# EAGLE design belamini-multi-a2 (EAGLE 9.6.0)
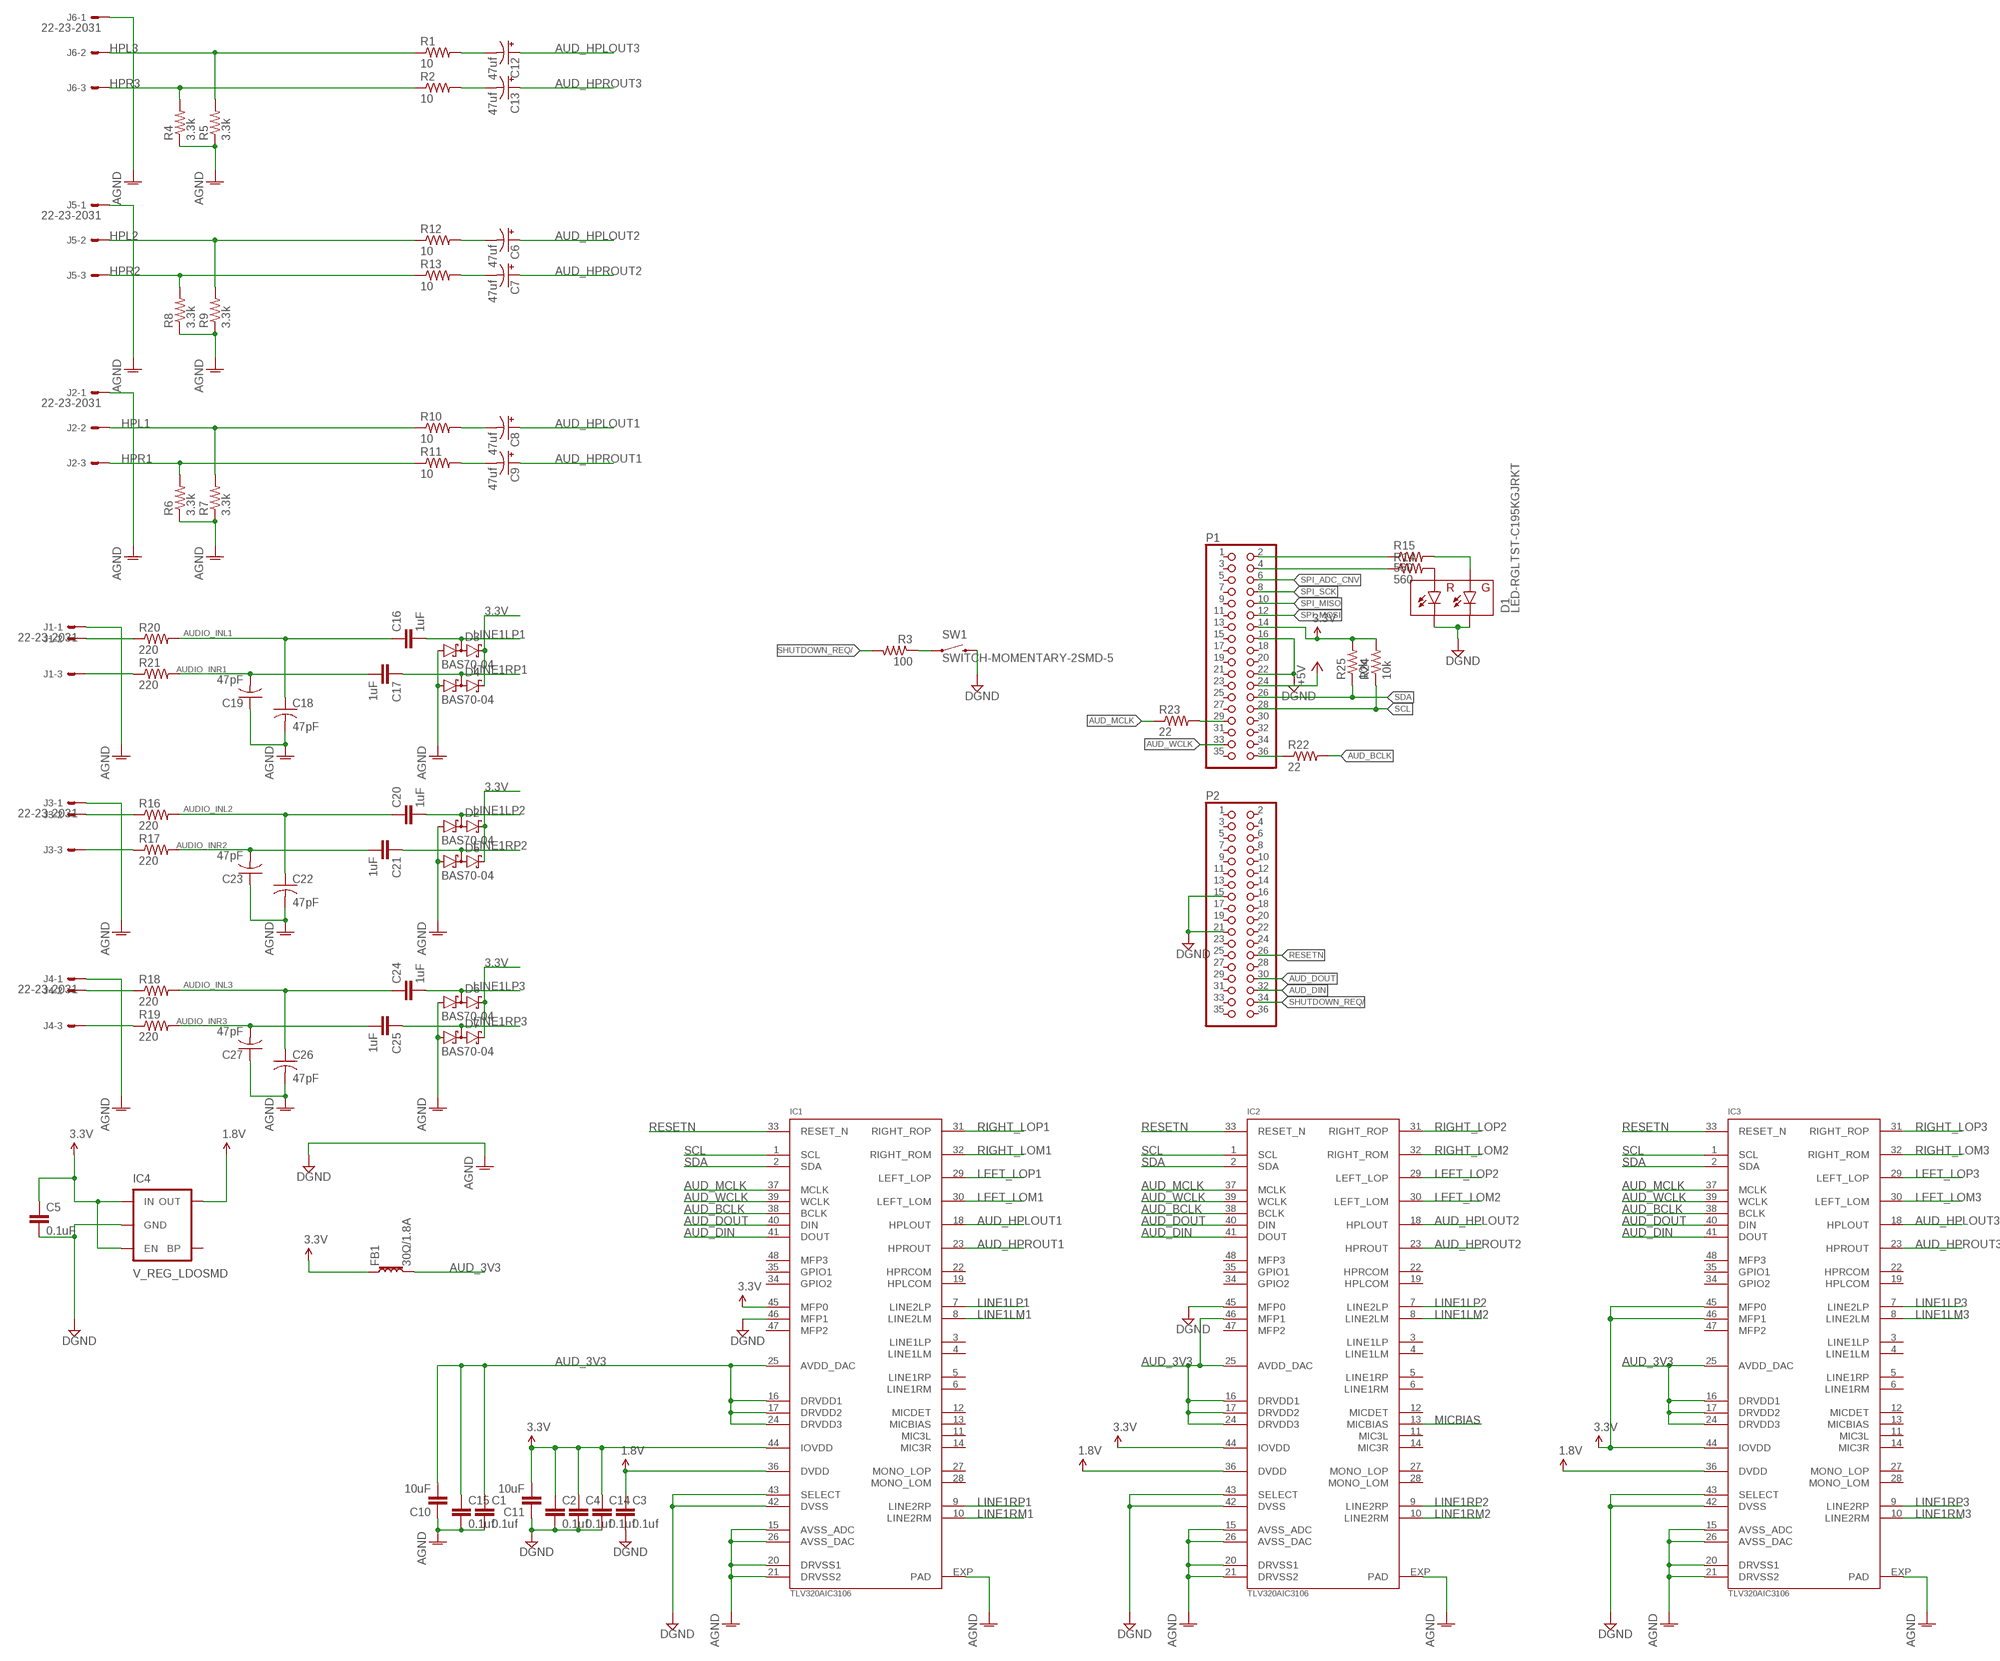
[diagram p0: schematic, sheet 1]

## Parts
C1  0.1uf  C-EUC0603  [C0603]
C2  0.1uf  C-EUC0603  [C0603]
C3  0.1uf  C-EUC0603  [C0603]
C4  0.1uf  C-EUC0603  [C0603]
C5  0.1uF  C-EUC0603  [C0603]
C6  47uf  CAP_POL1206  [EIA3216]
C7  47uf  CAP_POL1206  [EIA3216]
C8  47uf  CAP_POL1206  [EIA3216]
C9  47uf  CAP_POL1206  [EIA3216]
C10  10uF  CAP0603-CAP  [0603-CAP]
C11  10uF  CAP0603-CAP  [0603-CAP]
C12  47uf  CAP_POL1206  [EIA3216]
C13  47uf  CAP_POL1206  [EIA3216]
C14  0.1uf  C-EUC0603  [C0603]
C15  0.1uf  C-EUC0603  [C0603]
C16  1uF  C-EUC0603  [C0603]
C17  1uF  C-EUC0603  [C0603]
C18  47pF  C0402-SMALL  [C0402-SMALL]
C19  47pF  C0402-SMALL  [C0402-SMALL]
C20  1uF  C-EUC0603  [C0603]
C21  1uF  C-EUC0603  [C0603]
C22  47pF  C0402-SMALL  [C0402-SMALL]
C23  47pF  C0402-SMALL  [C0402-SMALL]
C24  1uF  C-EUC0603  [C0603]
C25  1uF  C-EUC0603  [C0603]
C26  47pF  C0402-SMALL  [C0402-SMALL]
C27  47pF  C0402-SMALL  [C0402-SMALL]
D1  LED-RGLTST-C195KGJRKT  [LTST-C195KGJRKT]
D2  BAS70-04  [SOT23]
D3  BAS70-04  [SOT23]
D4  BAS70-04  [SOT23]
D5  BAS70-04  [SOT23]
D6  BAS70-04  [SOT23]
D7  BAS70-04  [SOT23]
FB1  30Ω/1.8A  FERRITE_BEAD-0603  [0603]
IC1  TLV320AIC3106  TLV320AIC3106IRGZR"  [QFN48]
IC2  TLV320AIC3106  TLV320AIC3106IRGZR"  [QFN48]
IC3  TLV320AIC3106  TLV320AIC3106IRGZR"  [QFN48]
IC4  V_REG_LDOSMD  [SOT23-5]
J1  22-23-2031  [22-23-2031]
J2  22-23-2031  [22-23-2031]
J3  22-23-2031  [22-23-2031]
J4  22-23-2031  [22-23-2031]
J5  22-23-2031  [22-23-2031]
J6  22-23-2031  [22-23-2031]
P1  PINHD-2X18  [2X18]
P2  PINHD-2X18  [2X18]
R1  10  R0402-SMALL  [C0402-SMALL]
R2  10  R0402-SMALL  [C0402-SMALL]
R3  100  R0402-SMALL  [C0402-SMALL]
R4  3.3k  R0402-SMALL  [C0402-SMALL]
R5  3.3k  R0402-SMALL  [C0402-SMALL]
R6  3.3k  R0402-SMALL  [C0402-SMALL]
R7  3.3k  R0402-SMALL  [C0402-SMALL]
R8  3.3k  R0402-SMALL  [C0402-SMALL]
R9  3.3k  R0402-SMALL  [C0402-SMALL]
R10  10  R0402-SMALL  [C0402-SMALL]
R11  10  R0402-SMALL  [C0402-SMALL]
R12  10  R0402-SMALL  [C0402-SMALL]
R13  10  R0402-SMALL  [C0402-SMALL]
R14  560  R0402-SMALL  [C0402-SMALL]
R15  560  R0402-SMALL  [C0402-SMALL]
R16  220  R0402-SMALL  [C0402-SMALL]
R17  220  R0402-SMALL  [C0402-SMALL]
R18  220  R0402-SMALL  [C0402-SMALL]
R19  220  R0402-SMALL  [C0402-SMALL]
R20  220  R0402-SMALL  [C0402-SMALL]
R21  220  R0402-SMALL  [C0402-SMALL]
R22  22  R0402-SMALL  [C0402-SMALL]
R23  22  R0402-SMALL  [C0402-SMALL]
R24  10k  R0402-SMALL  [C0402-SMALL]
R25  10k  R0402-SMALL  [C0402-SMALL]
SW1  SWITCH-MOMENTARY-2SMD-5  [TACTILE_SWITCH_SMD-4]

## Nets
1.8V: C3.1 IC1.36(DVDD) IC2.36(DVDD) IC3.36(DVDD) IC4.5(OUT)
3.3V: C2.1 C4.1 C5.1 C11.2 C14.1 D2.2(C2) D3.2(C2) D4.2(C2) D5.2(C2) D6.2(C2) D7.2(C2) FB1.1 IC1.44(IOVDD) IC1.45(MFP0) IC2.44(IOVDD) IC3.44(IOVDD) IC3.45(MFP0) IC3.46(MFP1) IC4.1(IN) IC4.3(EN) P1.14 R24.P$2 R25.P$2
+5V: P1.24
AGND: C1.2 C2.2 C3.2 C4.2 C5.2 C10.1 C11.1 C14.2 C15.2 C18.P$2 C19.P$1 C22.P$2 C23.P$1 C26.P$2 C27.P$1 D1.P$3(GC) D1.P$4(RC) D2.1(A1) D3.1(A1) D4.1(A1) D5.1(A1) D6.1(A1) D7.1(A1) IC1.15(AVSS_ADC) IC1.20(DRVSS1) IC1.21(DRVSS2) IC1.26(AVSS_DAC) IC1.42(DVSS) IC1.43(SELECT) IC1.46(MFP1) IC1.EXP(PAD) IC2.15(AVSS_ADC) IC2.20(DRVSS1) IC2.21(DRVSS2) IC2.26(AVSS_DAC) IC2.42(DVSS) IC2.43(SELECT) IC2.45(MFP0) IC2.EXP(PAD) IC3.15(AVSS_ADC) IC3.20(DRVSS1) IC3.21(DRVSS2) IC3.26(AVSS_DAC) IC3.42(DVSS) IC3.43(SELECT) IC3.EXP(PAD) IC4.2(GND) J1.1 J2.1 J3.1 J4.1 J5.1 J6.1 P1.16 P1.22 P2.15 P2.21 R4.P$1 R5.P$1 R6.P$1 R7.P$1 R8.P$1 R9.P$1 SW1.4 ; supply symbol labelled DGND
AUD_3V3: C1.1 C10.2 C15.1 FB1.2 IC1.16(DRVDD1) IC1.17(DRVDD2) IC1.24(DRVDD3) IC1.25(AVDD_DAC) IC2.16(DRVDD1) IC2.17(DRVDD2) IC2.24(DRVDD3) IC2.25(AVDD_DAC) IC2.46(MFP1) IC3.16(DRVDD1) IC3.17(DRVDD2) IC3.24(DRVDD3) IC3.25(AVDD_DAC)
AUD_BCLK: IC1.38(BCLK) IC2.38(BCLK) IC3.38(BCLK) R22.P$2
AUD_DIN: IC1.41(DOUT) IC2.41(DOUT) IC3.41(DOUT) P2.32
AUD_DOUT: IC1.40(DIN) IC2.40(DIN) IC3.40(DIN) P2.30
AUD_HPLOUT1: C8.A(+) IC1.18(HPLOUT)
AUD_HPLOUT2: C6.A(+) IC2.18(HPLOUT)
AUD_HPLOUT3: C12.A(+) IC3.18(HPLOUT)
AUD_HPROUT1: C9.A(+) IC1.23(HPROUT)
AUD_HPROUT2: C7.A(+) IC2.23(HPROUT)
AUD_HPROUT3: C13.A(+) IC3.23(HPROUT)
AUD_MCLK: IC1.37(MCLK) IC2.37(MCLK) IC3.37(MCLK) R23.P$1
AUD_WCLK: IC1.39(WCLK) IC2.39(WCLK) IC3.39(WCLK) P1.33
AUDIO_INL1: C16.1 C18.P$1 R20.P$2
AUDIO_INL2: C20.1 C22.P$1 R16.P$2
AUDIO_INL3: C24.1 C26.P$1 R18.P$2
AUDIO_INR1: C17.2 C19.P$2 R21.P$2
AUDIO_INR2: C21.2 C23.P$2 R17.P$2
AUDIO_INR3: C25.2 C27.P$2 R19.P$2
HPL1: J2.2 R7.P$2 R10.P$1
HPL2: J5.2 R9.P$2 R12.P$1
HPL3: J6.2 R1.P$1 R5.P$2
HPR1: J2.3 R6.P$2 R11.P$1
HPR2: J5.3 R8.P$2 R13.P$1
HPR3: J6.3 R2.P$1 R4.P$2
LEFT_LOM1: IC1.30(LEFT_LOM)
LEFT_LOM2: IC2.30(LEFT_LOM)
LEFT_LOM3: IC3.30(LEFT_LOM)
LEFT_LOP1: IC1.29(LEFT_LOP)
LEFT_LOP2: IC2.29(LEFT_LOP)
LEFT_LOP3: IC3.29(LEFT_LOP)
LINE1LM1: IC1.8(LINE2LM)
LINE1LM2: IC2.8(LINE2LM)
LINE1LM3: IC3.8(LINE2LM)
LINE1LP1: C16.2 D3.3(C1A2) IC1.7(LINE2LP)
LINE1LP2: C20.2 D2.3(C1A2) IC2.7(LINE2LP)
LINE1LP3: C24.2 D6.3(C1A2) IC3.7(LINE2LP)
LINE1RM1: IC1.10(LINE2RM)
LINE1RM2: IC2.10(LINE2RM)
LINE1RM3: IC3.10(LINE2RM)
LINE1RP1: C17.1 D4.3(C1A2) IC1.9(LINE2RP)
LINE1RP2: C21.1 D5.3(C1A2) IC2.9(LINE2RP)
LINE1RP3: C25.1 D7.3(C1A2) IC3.9(LINE2RP)
MICBIAS: IC2.13(MICBIAS)
N$1: J1.2 R20.P$1
N$2: C6.C(-) R12.P$2
N$3: C7.C(-) R13.P$2
N$4: J1.3 R21.P$1
N$5: J3.2 R16.P$1
N$6: D1.P$2(RA) R14.P$2
N$7: J3.3 R17.P$1
N$8: C12.C(-) R1.P$2
N$9: J4.2 R18.P$1
N$10: C13.C(-) R2.P$2
N$11: J4.3 R19.P$1
N$13: D1.P$1(GA) R15.P$2
N$15: P1.4 R14.P$1
N$16: P1.2 R15.P$1
N$22: P1.29 R23.P$2
N$23: P1.36 R22.P$1
N$54: C8.C(-) R10.P$2
N$58: R3.P$1 SW1.1
N$59: C9.C(-) R11.P$2
RESETN: IC1.33(RESET_N) IC2.33(RESET_N) IC3.33(RESET_N) P2.26
RIGHT_LOM1: IC1.32(RIGHT_ROM)
RIGHT_LOM2: IC2.32(RIGHT_ROM)
RIGHT_LOM3: IC3.32(RIGHT_ROM)
RIGHT_LOP1: IC1.31(RIGHT_ROP)
RIGHT_LOP2: IC2.31(RIGHT_ROP)
RIGHT_LOP3: IC3.31(RIGHT_ROP)
SCL: IC1.1(SCL) IC2.1(SCL) IC3.1(SCL) P1.28 R24.P$1
SDA: IC1.2(SDA) IC2.2(SDA) IC3.2(SDA) P1.26 R25.P$1
SHUTDOWN_REQ/: P2.34 R3.P$2
SPI_ADC_CNV: P1.6
SPI_MISO: P1.10
SPI_MOSI: P1.12
SPI_SCK: P1.8
Unconnected: IC1.3(LINE1LP) IC1.4(LINE1LM) IC1.5(LINE1RP) IC1.6(LINE1RM) IC1.11(MIC3L) IC1.12(MICDET) IC1.13(MICBIAS) IC1.14(MIC3R) IC1.19(HPLCOM) IC1.22(HPRCOM) IC1.27(MONO_LOP) IC1.28(MONO_LOM) IC1.34(GPIO2) IC1.35(GPIO1) IC1.47(MFP2) IC1.48(MFP3) IC2.3(LINE1LP) IC2.4(LINE1LM) IC2.5(LINE1RP) IC2.6(LINE1RM) IC2.11(MIC3L) IC2.12(MICDET) IC2.14(MIC3R) IC2.19(HPLCOM) IC2.22(HPRCOM) IC2.27(MONO_LOP) IC2.28(MONO_LOM) IC2.34(GPIO2) IC2.35(GPIO1) IC2.47(MFP2) IC2.48(MFP3) IC3.3(LINE1LP) IC3.4(LINE1LM) IC3.5(LINE1RP) IC3.6(LINE1RM) IC3.11(MIC3L) IC3.12(MICDET) IC3.13(MICBIAS) IC3.14(MIC3R) IC3.19(HPLCOM) IC3.22(HPRCOM) IC3.27(MONO_LOP) IC3.28(MONO_LOM) IC3.34(GPIO2) IC3.35(GPIO1) IC3.47(MFP2) IC3.48(MFP3) IC4.4(BP) P1.1 P1.3 P1.5 P1.7 P1.9 P1.11 P1.13 P1.15 P1.17 P1.18 P1.19 P1.20 P1.21 P1.23 P1.25 P1.27 P1.30 P1.31 P1.32 P1.34 P1.35 P2.1 P2.2 P2.3 P2.4 P2.5 P2.6 P2.7 P2.8 P2.9 P2.10 P2.11 P2.12 P2.13 P2.14 P2.16 P2.17 P2.18 P2.19 P2.20 P2.22 P2.23 P2.24 P2.25 P2.27 P2.28 P2.29 P2.31 P2.33 P2.35 P2.36

## Library data of the parts
C1-C4 C14 C15 = rcl:C-EU: CAPACITOR, European symbol; MANEX: 123-0001056
C5 = rcl:C-EU: CAPACITOR, European symbol; MANEX: 123-0001087
C6-C9 C12 C13 = SparkFun-Capacitors:CAP_POL: Capacitor Polarized These are standard SMD and PTH capacitors. Normally 10uF, 47uF, and 100uF in electrolytic and tantalum varieties. Always verify the external diameter of the through hole cap, it varies with capacity, voltage, and manufacturer. The EIA devices should be standard.; MANEX: 123-0001196
C10 C11 = SparkFun-Passives:CAP: Capacitor Standard 0603 ceramic capacitor, and 0.1" leaded capacitor.; MANEX: 123-0001127
C16 C17 C20 C21 C24 C25 = rcl:C-EU: CAPACITOR, European symbol; MANEX: 123-0001032
C18 C19 C22 C23 C26 C27 = custom:C0402-SMALL; MANEX: 123-0001115
D1 = SparkFun-LED:LED-RG: LiteOn Technology Corporation LTST-C195KGJRKT - LED GREEN/RED CLEAR 0606 SMD Color: Red/Green Lens Transparency: Clear Lens Style/Size: Rectangle with Flat top, 1.10 x 1.5 mm mC Rating45mcd Red, 35 mcd Green Current: 20mA Red, 20mA Green Forward Voltage: 2V Red, 2V Green Packages: 0606 SparkFun Products: Electric Imp imp002 Breakout <[https://www.sparkfun.com/products/12958]>; PROD_ID: DIO-12140
D2-D7 = diode:BAS70-04: Silicon Schottky Diodes General-purpose diode for high-speed switching
FB1 = SparkFun-Coils:FERRITE_BEAD: Ferrite Bead (blocks, cores, rings, chokes, etc.) Inductor with layers of ferrite used to suppress high frequencies. Often used to isolate high frequency noise. SparkFun Products: IOIO-OTG - V2.2 <https://www.sparkfun.com/products/13613> SparkFun SAMD21 Mini Breakout <https://www.sparkfun.com/products/13664> SparkFun 6 Degrees of Freedom Breakout - LSM6DS3 <https://www.sparkfun.com/products/13339> SparkFun SAMD21 Dev Breakout <https://www.sparkfun.com/products/13672>; PROD_ID: NDUC-13805
IC1-IC3 = custom:TLV320AIC3106IRGZR
IC4 = SparkFun-PowerIC:V_REG_LDO: Voltage Regulator LDO Standard 150mA LDO voltage regulator in SOT-23 layout. Micrel part MIC5205. BP (by-pass) pin is used to lower output noise with 470pF cap.; MANEX: 140-0001616
J1-J6 = con-molex:22-23-2031: .100" (2.54mm) Center Header - 3 Pin; MF: MOLEX; MPN: 22-23-2031; OC_FARNELL: 1462950; OC_NEWARK: 30C0862
P1 P2 = pinhead:PINHD-2X18: PIN HEADER
R1 R2 R4-R21 = custom:R0402-SMALL; MANEX: 110-0002014
R3 R22-R25 = custom:R0402-SMALL
SW1 = custom:SWITCH-MOMENTARY-2: Various NO switches- pushbuttons, reed, etc

## Board
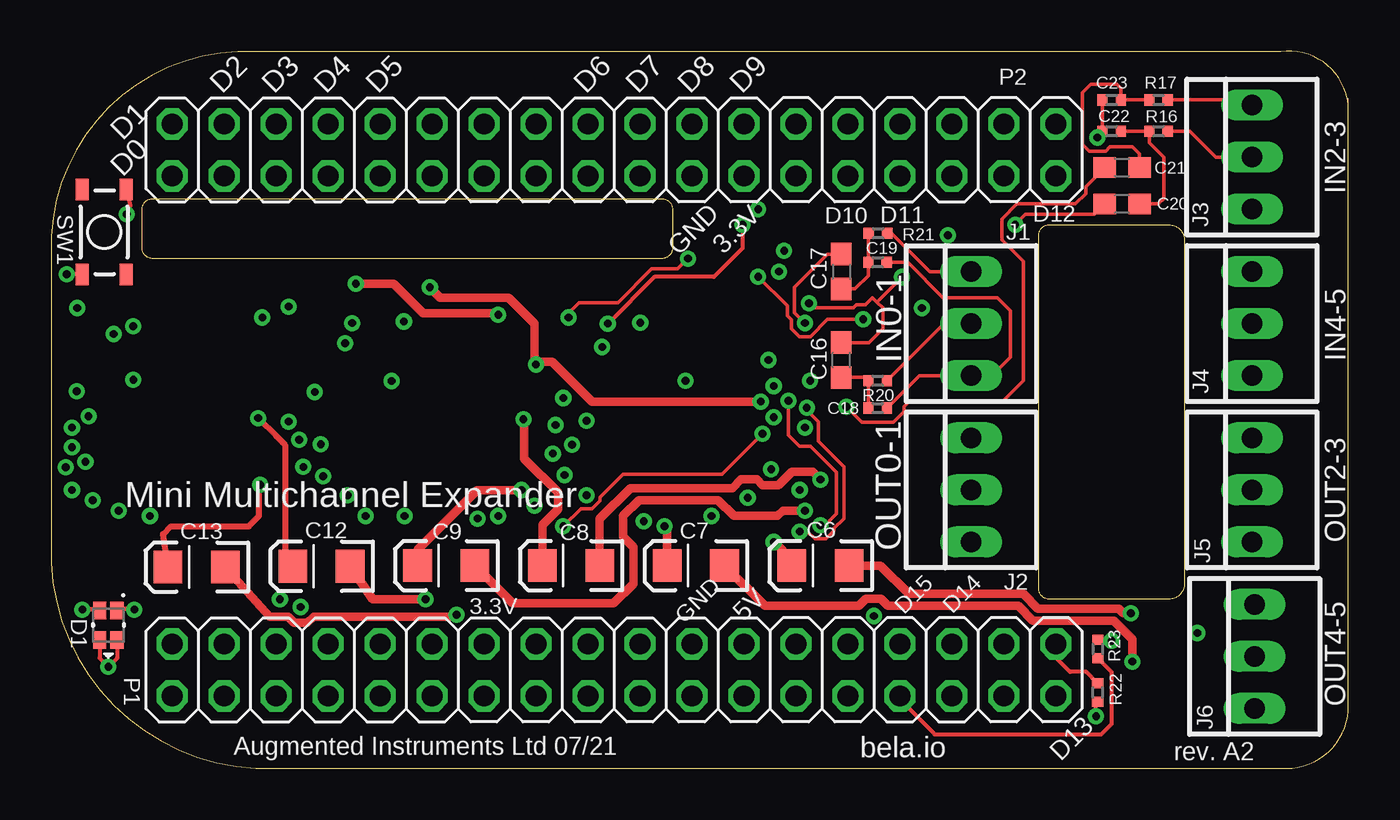
[diagram p1: board, top side]
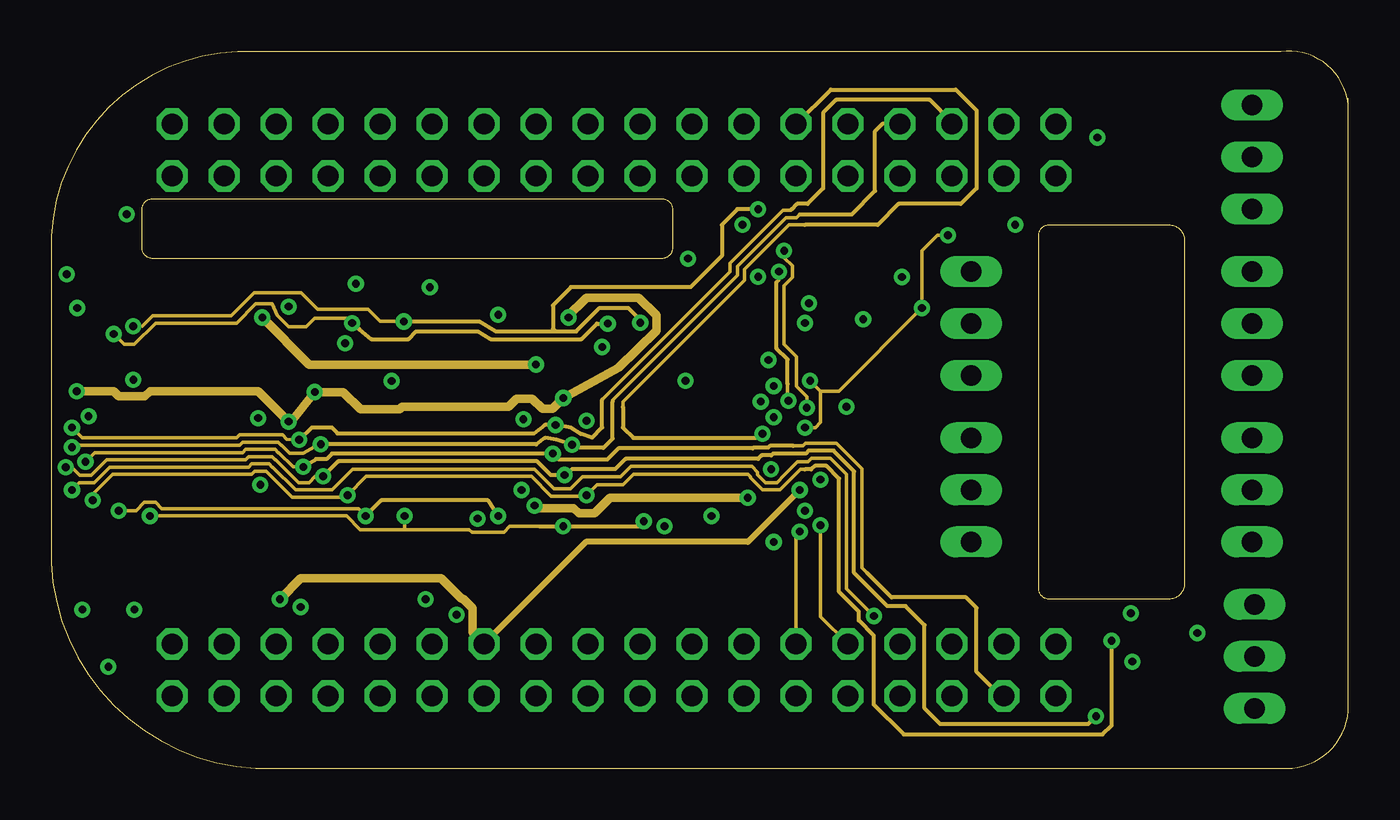
[diagram p2: board, inner layer Route2]
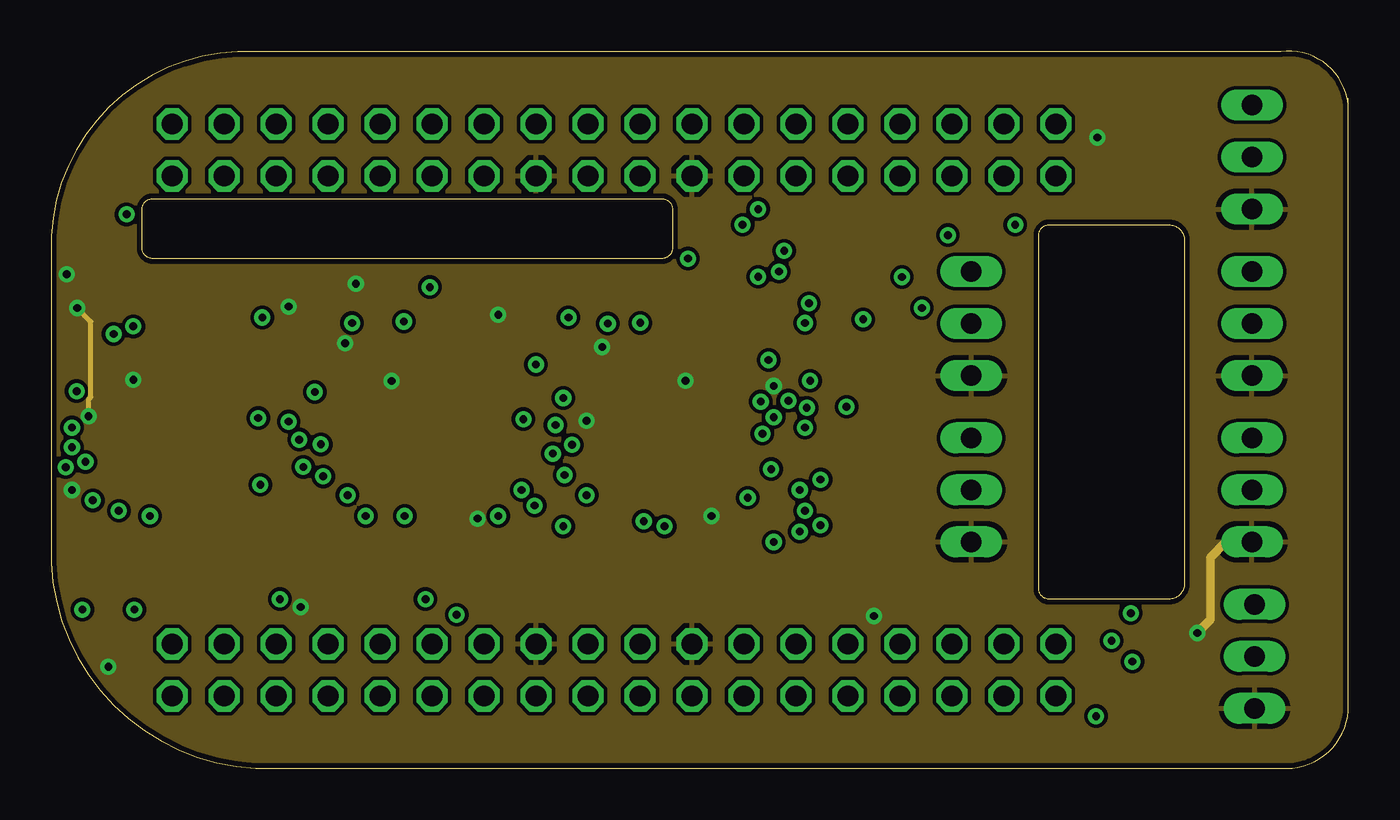
[diagram p3: board, inner layer Route3]
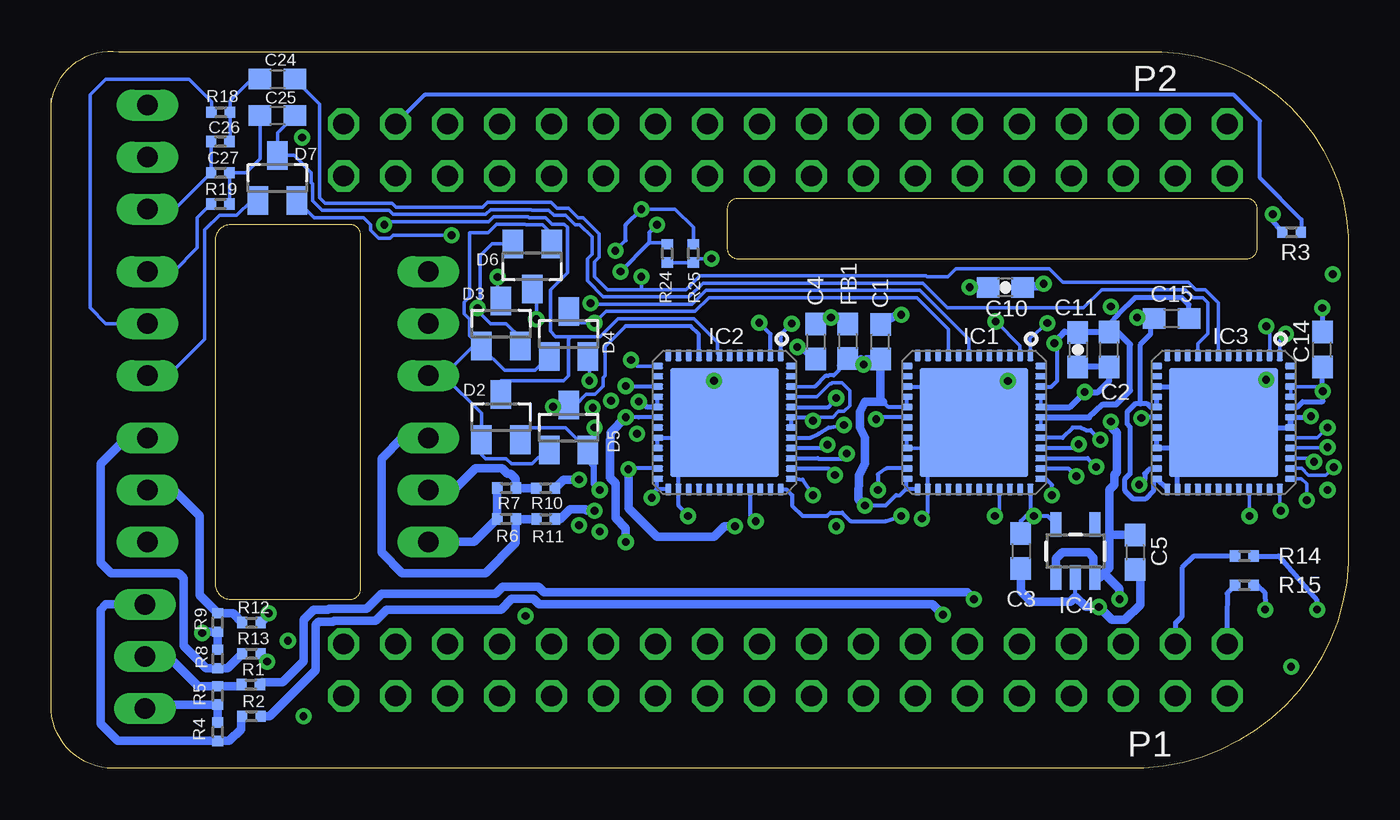
[diagram p4: board, bottom side, seen from below]

Size 63.38 x 35.03 mm. Coordinates in mm from the lower left corner, seen from the top.
Outline: 63.38,32.47 63.38,2.8 arc-90 60.08,0.01 10,0.01 arc-90 0,11.03 0,26.03 arc-90 10,35.01 60.08,35.01 arc-90 63.38,32.47
Outline: 63.38,32.47 63.38,32.72
Outline: 30.36,27.32 30.36,25.41 arc-90 29.85,24.9 4.96,24.9 arc-90 4.45,25.41 4.45,27.32 arc-90 4.96,27.82 29.85,27.82 arc-90 30.36,27.32
Outline: 48.77,26.55 54.61,26.55 arc-90 55.37,25.79 55.37,9.03 arc-90 54.61,8.27 48.77,8.27 arc-90 48.26,8.77 48.26,26.05 arc-90 48.77,26.55
Copper layers (1*2*3*16): Top 0.035mm / dielectric 1.5mm / Route2 0.035mm / dielectric 0.15mm / Route3 0.035mm / dielectric 0.2mm / Bottom 0.035mm
Design rules "default *": minimum track width 7mil, minimum drill 15mil, track to track 7mil, track to pad 7mil, pad to pad 7mil, via to via 7mil, smd to smd 0mil, copper to edge 10mil, drill to drill 7mil, minimum pad ring 10mil, minimum via ring 8mil, stop-mask expansion 4mil, vias tented up to drill 20mil, thermal gap 10mil

### Footprints (pad centres in the part's own frame; a part is rotated, then mirrored left to right if it is on the bottom)
C0603 = smd 1.1 x 1: 1 -0.85,0; 2 0.85,0
EIA3216 = smd 1.4 x 1.6: A 1.4,0; C -1.4,0
0603-CAP = smd 1.1 x 1: 1 -0.85,0; 2 0.85,0
C0402-SMALL = smd 0.5 x 0.55: P$1 -0.45,0; P$2 0.45,0
LTST-C195KGJRKT = smd 0.85 x 0.65: P$1 -0.725,0.425; P$2 -0.725,-0.425; P$3 0.725,0.425; P$4 0.725,-0.425
SOT23 = smd 1 x 1.4: 1 -0.95,-1.1; 2 0.95,-1.1; 3 0,1.1
0603 = smd 1.1 x 1: 1 -0.85,0; 2 0.85,0
QFN48 = smd 0.55 x 0.3: 1 -3.275,2.75; 2 -3.275,2.25; 3 -3.275,1.75; 4 -3.275,1.25; 5 -3.275,0.75; 6 -3.275,0.25; 7 -3.275,-0.25; 8 -3.275,-0.75; 9 -3.275,-1.25; 10 -3.275,-1.75; 11 -3.275,-2.25; 12 -3.275,-2.75; 25 3.275,-2.75; 26 3.275,-2.25; 27 3.275,-1.75; 28 3.275,-1.25; 29 3.275,-0.75; 30 3.275,-0.25; 31 3.275,0.25; 32 3.275,0.75; 33 3.275,1.25; 34 3.275,1.75; 35 3.275,2.25; 36 3.275,2.75 | smd 0.3 x 0.55: 13 -2.75,-3.275; 14 -2.25,-3.275; 15 -1.75,-3.275; 16 -1.25,-3.275; 17 -0.75,-3.275; 18 -0.25,-3.275; 19 0.25,-3.275; 20 0.75,-3.275; 21 1.25,-3.275; 22 1.75,-3.275; 23 2.25,-3.275; 24 2.75,-3.275; 37 2.75,3.275; 38 2.25,3.275; 39 1.75,3.275; 40 1.25,3.275; 41 0.75,3.275; 42 0.25,3.275; 43 -0.25,3.275; 44 -0.75,3.275; 45 -1.25,3.275; 46 -1.75,3.275; 47 -2.25,3.275; 48 -2.75,3.275 | smd 5.309 x 5.309: EXP 0,0
SOT23-5 = smd 0.55 x 1.2: 1 -0.95,-1.3; 2 0,-1.3; 3 0.95,-1.3; 4 0.95,1.3; 5 -0.95,1.3
22-23-2031 = drill 1 long: 1 -2.54,0; 2 0,0; 3 2.54,0
2X18 = drill 1.016 octagon: 1 -21.59,-1.27; 2 -21.59,1.27; 3 -19.05,-1.27; 4 -19.05,1.27; 5 -16.51,-1.27; 6 -16.51,1.27; 7 -13.97,-1.27; 8 -13.97,1.27; 9 -11.43,-1.27; 10 -11.43,1.27; 11 -8.89,-1.27; 12 -8.89,1.27; 13 -6.35,-1.27; 14 -6.35,1.27; 15 -3.81,-1.27; 16 -3.81,1.27; 17 -1.27,-1.27; 18 -1.27,1.27; 19 1.27,-1.27; 20 1.27,1.27; 21 3.81,-1.27; 22 3.81,1.27; 23 6.35,-1.27; 24 6.35,1.27; 25 8.89,-1.27; 26 8.89,1.27; 27 11.43,-1.27; 28 11.43,1.27; 29 13.97,-1.27; 30 13.97,1.27; 31 16.51,-1.27; 32 16.51,1.27; 33 19.05,-1.27; 34 19.05,1.27; 35 21.59,-1.27; 36 21.59,1.27
TACTILE_SWITCH_SMD-4 = smd 1.05 x 0.65: 1 -2.075,1.075; 2 2.075,1.075; 3 -2.075,-1.075; 4 2.075,-1.075

### Placement (x,y rotation side)
C1  22.86,20.84 90 bottom
C2  11.69,20.46 90 bottom
C3  16,10.61 270 bottom
C4  26.03,20.85 270 bottom
C5  10.43,10.56 270 bottom
C6  37.59,9.91 180 top
C7  31.5,9.91 180 top
C8  25.4,9.91 180 top
C9  19.31,9.91 180 top
C10  16.76,23.5 180 bottom
C11  13.22,20.45 270 bottom
C12  13.21,9.87 180 top
C13  7.11,9.83 180 top
C14  1.27,20.46 90 bottom
C15  8.64,21.98 0 bottom
C16  38.61,19.95 90 top
C17  38.61,24.27 270 top
C18  40.39,17.6 0 top
C19  40.38,24.72 180 top
C20  52.33,27.57 180 top
C21  52.33,29.35 0 top
C22  51.82,31.13 180 top
C23  51.82,32.65 0 top
C24  52.33,33.67 0 bottom
C25  52.33,31.89 180 bottom
C26  55.12,30.62 180 bottom
C27  55.12,29.09 0 bottom
D1  2.8,7 270 top
D2  41.4,17.16 0 bottom
D3  41.4,21.73 0 bottom
D4  38.1,21.22 0 bottom
D5  38.1,16.65 0 bottom
D6  39.88,24.52 180 bottom
D7  52.33,28.84 0 bottom
FB1  24.46,20.86 270 bottom
IC1  18.29,16.9 270 bottom
IC2  30.48,16.9 270 bottom
IC3  6.1,16.9 270 bottom
IC4  13.34,10.61 0 bottom
J1  44.96,21.73 90 top
J2  44.96,13.6 90 top
J3  58.68,29.86 90 top
J4  58.68,21.73 90 top
J5  58.68,13.6 90 top
J6  58.8,5.47 90 top
P1  27.5,4.81 0 top
P2  27.5,30.21 0 top
R1  53.63,4.09 0 bottom
R2  53.6,2.55 0 bottom
R3  2.77,26.19 0 bottom
R4  55.25,1.79 270 bottom
R5  55.25,3.57 90 bottom
R6  41.13,12.19 0 bottom
R7  41.13,13.69 0 bottom
R8  55.25,5.34 270 bottom
R9  55.25,7.12 90 bottom
R10  39.22,13.69 0 bottom
R11  39.22,12.18 0 bottom
R12  53.6,7.12 0 bottom
R13  53.6,5.6 0 bottom
R14  5.08,10.37 0 bottom
R15  5.08,8.95 0 bottom
R16  54.1,31.13 180 top
R17  54.1,32.65 180 top
R18  55.1,32.05 0 bottom
R19  55.12,27.57 0 bottom
R20  40.39,18.93 180 top
R21  40.4,26.14 180 top
R22  51.13,3.71 270 top
R23  51.14,5.83 270 top
R24  33.28,25.16 270 bottom
R25  32.01,25.16 270 bottom
SW1  2.59,26.2 270 top

### Tracks (layer width: path | path; a pad name or v marks a point on that pad's centre or on a via)
1.8V  (via drill 0.38)
  Route2 0.178: v3.3,12.58 4.15,12.58 4.55,12.99 5.1,12.99 5.41,12.69 15.01,12.69 v15.37,12.33
  Route2 0.203: v21.85,12.33 21.34,13.09 16.13,13.09 v15.37,12.33
  Bottom 0.178: IC3.36 3.35,12.63 v3.3,12.58
  Bottom 0.203: 15.54,12.54 16,12.08 C3.1 | IC1.36 15.54,12.54 | IC4.5 14.7,12.33 v15.37,12.33 15.54,12.5 15.54,12.54 | v21.85,12.33 22.61,12.08 24.32,12.08 24.74,12.49 25.3,12.49 25.47,12.33 26.67,12.33 27.18,12.84 27.18,13.35 27.46,13.63 IC2.36
3.3V  (via drill 0.38)
  Top 0.178: v31.12,24.9 30.61,24.39 29.34,24.39 27.69,22.74 25.78,22.74 25.27,22.23 v25.27,22.03
  Route2 0.178: v37.09,18.93 37.59,18.43 | 37.59,18.43 37.59,16.9 37.34,16.65 v36.83,16.65 | 37.59,18.43 38.48,18.43 v42.55,22.49 42.55,25.28 43.31,26.05 v43.82,26.05
  Route2 0.305: P1.14 26.13,11.06 34.04,11.06 v36.58,13.6
  Route2 0.406: v25.27,22.03 25.19,22.03 26.16,23 28.7,23 29.58,22.12 29.58,21.37 27.72,19.57 v25.02,18.09 24.49,17.56 24.01,17.56 23.5,18.04 22.74,18.04 22.35,17.66 17.15,17.66 17.02,17.54 15.12,17.54 14.27,18.38 v12.88,18.38 11.73,16.94 v11.61,16.94 10.12,18.43 4.83,18.43 4.57,18.17 3.3,18.17 3.05,18.43 v1.24,18.43 | P1.14 20.59,6.64 20.59,7.82 20.14,8.28 20.06,8.28 19.05,9.28 12.19,9.28 v11.18,8.27
  Bottom 0.178: IC1.45 IC1.44 | 1.27,18.68 1.24,18.65 IC3.46 IC3.45 | D6.2 41.83,25.62 42.42,25.03 42.42,22.74 | 42.42,22.74 42.42,22.24 41.91,21.73 41.15,21.73 40.45,21.03 D3.2 | D4.2 37.09,20.05 v37.09,18.93 | v36.83,16.65 36.83,16.39 36.9,16.33 36.9,15.8 D5.2 38.25,16.65 40.64,16.65 40.64,16.24 D2.2 | 42.42,22.74 42.55,22.62 v42.55,22.49 | D7.2 50.53,26.9 48.11,26.9 47.77,26.55 47.77,26.28 47.38,25.89 46.83,25.89 46.68,26.05 v43.82,26.05 | R24.P$2 R25.P$2 31.81,24.9 v31.12,24.9
  Bottom 0.203: 11.85,19.44 C2.1 | IC2.44 25.41,17.65 v25.02,18.09 | FB1.1 24.77,22.03 v25.27,22.03
  Bottom 0.254: 1.27,18.68 C14.1 | IC3.44 2.5,17.65 2.23,17.92 1.27,17.92 1.24,17.95 v1.24,18.43 1.24,18.65
  Bottom 0.305: IC1.44 13.62,17.65 v12.88,18.38 12.24,18.38 11.69,18.93 C2.1 13.21,19.61 C11.2 | D5.2 37.15,15.07 36.87,14.79 36.87,13.89 v36.58,13.6
  Bottom 0.406: 11.69,11.31 11.69,9.79 11.94,9.54 | 11.69,11.31 11.69,13.6 11.43,13.86 11.43,14.35 11.31,14.47 11.31,16.39 11.53,16.61 11.53,16.85 11.61,16.87 v11.61,16.94 | 11.94,9.54 12.16,9.31 IC4.3 12.45,9.38 12.45,10.3 12.7,10.55 13.97,10.55 14.29,10.24 IC4.1 | v11.18,8.27 11.18,8.77 11.94,9.54 | C4.1 25.7,22.03 v25.27,22.03 24.95,22.03 | C5.1 11.59,11.41 11.69,11.31
AGND  (via drill 0.38)
  Top 0.178: C18.P$2 42.43,19.19 J1.1 45.98,19.19 46.87,20.08 46.87,22.36 46.23,23 43.59,23 41.86,24.72 C19.P$1 | C23.P$1 C22.P$2 51.37,31.06 v51.13,30.82
  Top 0.203: D1.P$4 2.37,5.39 v2.8,4.96 3.22,5.39 D1.P$3 | SW1.4 1.39,24.15 v0.76,24.14
  Top 0.406: v14.89,23.67 16.74,23.67 18.17,22.24 21.76,22.24 v21.85,22.15
  Route2 0.178: v1.02,13.6 1.38,13.96 2.1,13.96 2.86,14.72 9.65,14.72 9.8,14.87 10.64,14.87 10.79,14.72 10.82,14.72 11.94,13.6 13.72,13.6 14.73,14.62 23.61,14.62 24.56,13.66 25.38,13.66 25.97,14.25 27.83,14.25 28.34,14.76 34.24,14.76 34.52,14.48 34.52,14.34 34.91,13.96 35.46,13.96 35.84,14.34 35.84,14.35 36.46,14.97 36.99,14.97 37.16,15.15 38.08,15.15 38.86,14.36 38.86,8.78 v40.2,7.44
  Route3 0.254: v1.83,17.2 1.83,18.02 1.94,18.14 1.94,21.82 v1.27,22.49
  Route3 0.406: v56.01,6.61 56.64,7.25 56.64,10.3 57.41,11.06 J5.1
  Bottom 0.178: IC1.42 IC1.43 | IC2.45 25.98,18.15 25.33,18.8 25.26,18.8 25.23,18.83 24.75,18.83 24.36,18.45 24.36,17.71 24.64,17.43 24.91,17.43 25.19,17.16 25.99,17.16 v26.16,16.98 | C26.P$2 C27.P$1 57.35,27.32 J3.1 | 44.2,19.19 42.35,17.34 D2.1 42.35,15.31 42.17,15.12 41.15,15.12 40.9,14.87 39.88,14.87 39.2,15.55 D5.1 | 44.2,19.19 J1.1 | D3.1 42.42,20.63 | 42.42,20.63 42.76,20.63 44.2,19.19 | D4.1 39.73,19.44 41.23,19.44 42.42,20.63 | D6.1 39.12,25.81 39.12,26.3 39.37,26.55 40.19,26.55 40.22,26.59 41.62,26.59 42.04,26.17 42.93,26.17 42.93,23.04 43.21,22.76 43.21,22.22 42.93,21.94 42.93,21.14 42.42,20.63 | D7.1 53.6,27.74 54.31,27.03 55.15,27.03 55.88,26.3 55.88,20.97 57.66,19.19 J4.1 | IC1.EXP 19.1,16.78
  Bottom 0.203: IC1.20 IC1.21 20.57,15.64 | IC1.15 20.04,18.65 IC1.EXP 19.06,16.9 20.32,15.63 | 20.57,15.64 20.43,15.64 19.1,16.78 v16.64,18.92 | IC1.26 20.57,15.64 | v20.83,12.2 20.83,12.27 20.55,12.52 20.55,13.6 20.51,13.66 | IC2.15 35.28,18.65 v35.31,18.68 | IC2.21 IC2.20 31.23,16.15 IC2.EXP v30.99,18.93 32.73,17.19 IC2.26 | v32.26,12.33 32.73,12.84 32.73,13.73 | 11.69,21.73 C2.2 | 11.23,22.18 v11.6,22.56 | IC2.42 IC2.43 26.34,17.15 v26.16,16.98 | 13.34,8.39 IC4.2 | C4.2 26.21,20 v26.93,20.58 | IC1.46 14.51,18.65 14.23,18.93 14.23,20.63 v14.36,20.76
  Bottom 0.254: 8.38,15.65 8.13,15.65 | IC3.15 8.41,18.65 8.38,18.68 8.38,15.65 | IC3.43 1.88,17.15 v1.83,17.2 | v1.27,22.49 C14.2 | C15.2 7.79,22.66 8.13,23 10.42,23 11.23,22.18 11.27,22.15 11.69,21.73 | 6.1,16.65 6.6,16.65 6.61,16.65 6.35,16.65 IC3.EXP | 6.1,16.65 IC3.42 | IC3.20 IC3.21 8.38,15.65 | 8.13,15.65 7.1,15.65 6.1,16.65 | IC3.26 8.35,15.43 8.13,15.65
  Bottom 0.305: v14.36,20.76 13.87,21.34 C11.1 13.21,21.31 C2.2 11.27,21.31 10.67,20.71 10.67,18.45 11.34,17.78 11.99,17.78 12.67,17.15 12.72,17.15 IC1.43 | IC3.42 IC3.43
  Bottom 0.406: v21.85,22.15 22.06,22.15 C1.2 | C10.1 15.84,23.56 14.99,23.56 v14.89,23.67 | C3.2 16,8.65 15.5,8.14 13.59,8.14 13.34,8.39 12.83,7.88 v12.19,7.88 11.56,7.25 10.92,7.25 10.17,8 10.17,9.46 C5.2 | R4.P$1 R5.P$1 58.62,3.12 J6.1 | R8.P$1 R9.P$1 55.95,6.67 v56.01,6.61 | R7.P$1 R6.P$1 42.71,11.06 J2.1
  other vias: 4.02,18.98
  pour Route3: 0,35.7 0,0.14 66.8,0.14 66.8,12.33 66.55,12.33 66.55,35.7
AUD_3V3  (via drill 0.38)
  Top 0.406: v18.5,23.51 19.01,23 22.35,23 23.62,21.73 23.62,19.86 | v23.68,19.73 23.55,19.86 23.62,19.86 | 23.62,19.86 24.47,19.86 26.42,17.92 v34.67,17.92
  Route2 0.406: v23.62,12.84 23.75,12.71 25.53,12.71 25.78,12.46 26.55,12.46 27.31,13.22 v34.04,13.22 | v23.68,19.73 12.62,19.73 v10.32,22.02
  Bottom 0.178: 26.07,18.65 IC2.46
  Bottom 0.203: v23.62,12.84 22.61,12.84 22.1,13.35 21.91,13.35 21.59,13.66 | 22.74,17.92 22.47,17.65 IC1.17 IC1.16 | 23.56,17.98 23.62,17.92 | IC1.25 21.56,13.63 21.59,13.66 | 21.59,13.66 21.59,14.12 IC1.24 | IC2.25 33.75,13.63 33.78,13.66 | 33.78,13.66 33.78,14.12 IC2.24 | v34.04,13.22 34.04,13.41 33.78,13.66 | 33.77,17.66 IC2.17 IC2.16 | 26.07,18.65 25.55,19.17 25.41,19.17 25.38,19.2 25.14,19.2 24.89,19.44 24.89,19.67 24.55,20.01 FB1.2 24.17,19.73 v23.68,19.73
  Bottom 0.254: IC3.25 IC3.24 9.52,14 9.52,13.56 9.93,13.16 10.51,13.16 10.92,13.56 10.92,13.59 10.92,13.6 10.92,13.61 10.92,14.14 10.67,14.39 10.67,16.68 10.82,16.82 10.82,17.4 10.41,17.81 10.16,17.81 | IC3.16 IC3.17 9.42,17.61 9.63,17.61 9.83,17.81 10.16,17.81 | C15.1 9.65,21.98 | v10.32,22.02 10.27,21.98 9.65,21.98 | IC2.17 34.27,17.65 34.53,17.92 v34.67,17.92 | 9.65,21.98 9.65,21.22 10.16,20.71 10.16,17.81
  Bottom 0.406: 22.74,17.92 22.86,17.92 | 22.86,17.92 23.62,17.92 23.86,17.41 23.86,16.65 23.62,16.14 23.62,14.87 23.92,14.32 23.94,13.16 v23.62,12.84 | 23.81,19.98 v23.68,19.73 | C1.1 23.55,19.99 v23.68,19.73 | v23.68,19.73 23.01,19.84 22.86,19.7 22.86,17.92 | C10.2 18.49,23.5 v18.5,23.51
AUD_BCLK  (via drill 0.38)
  Top 0.203: v51.06,2.55 51.06,3.19 R22.P$2
  Route2 0.178: v13.3,14.27 12.91,14.27 12.6,13.96 12.09,13.96 10.97,15.07 10.94,15.07 10.79,15.23 9.65,15.23 9.5,15.07 2.71,15.07 1.95,14.31 1.4,14.31 1,14.72 v0.71,14.72
  Route2 0.203: v13.3,14.27 14.03,15 23.75,15 24.42,14.33 v25.09,14.33 25.47,14.62 27.56,14.62 28.07,15.12 34.55,15.12 34.71,15.29 35.19,15.29 35.28,15.38 36.87,15.38 37.01,15.52 38.23,15.52 39.23,14.51 39.23,9.55 40.86,7.92 41.75,7.92 42.67,7 42.67,2.93 43.44,2.17 50.68,2.17 v51.06,2.55
  Bottom 0.178: IC3.38 2.29,14.65 1.95,14.31 1.11,14.31 v0.71,14.72
  Bottom 0.203: IC1.38 13.68,14.65 v13.3,14.27 | IC2.38 25.41,14.65 v25.09,14.33
AUD_DIN  (via drill 0.38)
  Route2 0.178: v1.02,16.65 1.53,16.14 9.06,16.14 9.21,16.29 11.3,16.29 11.51,16.08 v12.12,16.06 | 36.2,27.32 36.15,27.26 35.77,27.26 33.17,24.67 33.17,24.26 26.93,18.01
  Route2 0.203: v12.12,16.06 12.73,16.65 13.72,16.65 14,16.37 23.59,16.37 24.13,16.77 v24.64,16.77 25.4,16.65 25.87,16.34 26.42,16.15 26.93,16.66 26.93,18.01 | P2.32 44.01,31.57 42.93,32.65 38.36,32.65 37.72,32.01 37.72,28.33 36.96,27.57 36.45,27.57 36.2,27.32
  Bottom 0.178: v1.02,16.65 1.53,16.14 2.81,16.14 IC3.41
  Bottom 0.203: v12.12,16.06 12.61,16.52 12.83,16.52 13.08,16.65 13.46,16.65 13.97,16.14 15,16.14 IC1.41 | IC2.41 26.28,16.15 25.87,16.35 25.4,16.65 v24.64,16.77
AUD_DOUT  (via drill 0.38)
  Route2 0.178: v13.18,15.83 13.04,15.81 12.32,15.39 11.65,15.39 11.26,15.78 11.24,15.78 11.08,15.94 9.36,15.94 9.2,15.78 1.12,15.78 v1.02,15.68 | 36.58,27.06 36.43,26.91 35.91,26.91 33.53,24.53 33.53,24.08 27.43,17.98 27.43,17.92
  Route2 0.203: v13.18,15.83 23.71,15.83 24.13,16.14 24.69,16.06 v25.45,15.81 25.61,15.65 26.98,15.65 27.43,16.1 27.43,17.92 | P2.30 40.62,31.48 40.26,31.13 40.26,28.2 39.12,27.06 36.58,27.06
  Bottom 0.178: IC3.40 1.05,15.65 v1.02,15.68
  Bottom 0.203: IC1.40 13.35,15.65 v13.18,15.83 | IC2.40 25.61,15.65 v25.45,15.81
AUD_HPLOUT1  (via drill 0.38)
  Top 0.406: v23.08,17.06 23.12,17.02 23.12,15.12 24.76,13.48 24.76,12.66 24.01,11.91 24,11.88 C8.A
  Bottom 0.203: IC1.18 22.98,17.15 v23.08,17.06
AUD_HPLOUT2  (via drill 0.38)
  Top 0.406: C6.A 36.2,10.16 v35.31,11.06
  Bottom 0.203: IC2.18 34.68,17.15 35.05,17.16 v35.31,17.16
  Bottom 0.406: v35.31,11.06 35.31,11.74 35.8,12.24 35.8,13.92 36.08,14.2 36.08,16.05 36.06,16.07 36.06,16.41 v35.31,17.16
AUD_HPLOUT3  (via drill 0.38)
  Top 0.305: v10.12,17.11 11.01,16.22 11.31,15.93 11.43,15.8 11.43,10.25 C12.A
  Bottom 0.254: IC3.18 10.08,17.15 v10.12,17.11
AUD_HPROUT1  (via drill 0.38)
  Top 0.406: v22.99,13.6 22.97,13.58 20.81,13.58 17.91,10.68 C9.A
  Bottom 0.203: IC1.23 22.57,14.65 22.99,14.36 v22.99,13.6
AUD_HPROUT2  (via drill 0.38)
  Top 0.406: C7.A 30.09,11.71 v29.97,11.82
  Bottom 0.203: IC2.23 35.15,14.65 v35.18,14.62
  Bottom 0.406: v29.97,11.82 30.48,11.82 30.99,11.31 33.78,11.31 35.18,12.71 v35.18,14.62
AUD_HPROUT3  (via drill 0.38)
  Top 0.305: C13.A 5.46,11.44 5.84,11.82 9.65,11.82 10.16,12.33 10.16,13.8 v10.22,13.85
  Bottom 0.254: IC3.23 9.42,14.61 9.75,14.61 9.95,14.4 9.95,14.12 v10.22,13.85
AUD_MCLK  (via drill 0.38)
  Top 0.203: v51.82,6.23 51.19,6.23 R23.P$1
  Route2 0.178: v2.03,13.09 2.03,13.39 3,14.36 9.79,14.36 9.95,14.51 10.49,14.51 11.76,13.24 14.38,13.24 v14.48,13.35 15.39,14.26 23.46,14.26 24.43,13.3 26.11,13.3 v26.16,13.35 26.67,13.85 27.94,13.85 28.45,14.36 34.04,14.36 34.17,14.23 34.17,14.19 34.76,13.6 35.6,13.6 36.61,14.6 36.83,14.6
  Route2 0.203: v51.82,6.23 51.82,2.11 51.37,1.66 41.66,1.66 40.2,3.12 40.2,6.48 39.46,7.22 39.46,7.66 38.5,8.62 38.5,14.16 37.87,14.78 37.32,14.78 37.14,14.6 36.83,14.6
  Bottom 0.178: IC3.37 2.29,14.15 2.03,13.9 v2.03,13.09
  Bottom 0.203: v14.48,13.35 14.48,13.85 14.73,14.11 14.99,14.15 IC1.37 | IC2.37 26.97,14.15 26.67,14.11 v26.16,13.35
AUD_WCLK  (via drill 0.38)
  Route2 0.178: v1.68,14.97 2.13,15.43 9.35,15.43 9.5,15.58 10.94,15.58 11.09,15.43 11.12,15.43 11.82,14.73 v12.32,14.73 | 39.88,9.54 39.63,9.79 39.63,14.64 38.38,15.89 36.86,15.89 36.73,15.76 36.26,15.76
  Route2 0.203: P1.33 46.38,3.54 45.21,4.71 45.21,7.85 44.71,8.35 41.06,8.35 39.88,9.54 | 36.26,15.76 35.12,15.76 35.03,15.67 34.33,15.67 34.29,15.63 27.72,15.63 27.17,15.08 24.81,15.08 v24.51,15.38 13.72,15.38 13.45,15.11 12.95,15.11 v12.32,14.73
  Bottom 0.178: IC3.39 1.85,15.15 v1.68,14.97
  Bottom 0.203: IC1.39 12.75,15.15 v12.32,14.73 | IC2.39 25.94,15.15 25.89,15.12 24.77,15.12 v24.51,15.38
AUDIO_INL1
  Top 0.178: C18.P$1 R20.P$2 39.77,19.1 C16.1
AUDIO_INL2
  Top 0.178: C22.P$1 R16.P$2 53.65,30.56 54.36,29.86 54.36,27.82 54.1,27.57 C20.1
AUDIO_INL3
  Bottom 0.178: C26.P$1 54.65,30.64 R18.P$2 54.65,32.61 53.6,33.67 C24.1
AUDIO_INR1
  Top 0.178: C17.2 39.28,23.42 39.93,24.06 C19.P$2 39.93,26.12 R21.P$2
AUDIO_INR2
  Top 0.178: R17.P$2 C23.P$2 52.27,33.22 52.07,33.41 50.8,33.41 50.4,33.01 50.4,30.49 50.73,30.16 51.53,30.16 51.74,30.36 52.83,30.36 53.18,30.02 C21.2
AUDIO_INR3
  Bottom 0.178: R19.P$2 C27.P$2 53.85,29.09 53.18,29.77 C25.2
HPL1
  Bottom 0.406: R10.P$1 R7.P$2 40.68,14.15 40.93,14.4 41.09,14.4 41.35,14.65 42.64,14.65 43.69,13.6 J2.2
HPL2
  Bottom 0.406: J5.2 57.41,13.6 56.14,12.33 56.14,8.46 R9.P$2 54.5,7.57 R12.P$1
HPL3
  Bottom 0.406: J6.2 57.66,5.47 56.21,4.02 R5.P$2 54.16,4.02 R1.P$1
HPR1
  Bottom 0.406: R11.P$1 R6.P$2 40.68,11.02 42.17,9.54 46.23,9.54 47.25,10.55 47.25,15.12 46.23,16.14 J2.3
HPR2
  Bottom 0.406: J5.3 59.69,16.14 60.96,14.87 60.96,10.04 60.45,9.54 57.15,9.54 56.9,9.28 56.9,5.98 55.81,4.89 R8.P$2 54.75,4.89 R13.P$1
HPR3
  Bottom 0.406: J6.3 60.71,8.01 60.96,7.76 60.96,2.17 60.13,1.34 R4.P$2 54.68,1.34 54.1,1.92 54.1,2.49 R2.P$1
LINE1LP1  (via drill 0.38)
  Top 0.178: v37.03,22.72 37.05,22.74 37.09,22.74 37.34,22.49 39.2,22.49 39.35,22.64 39.78,22.64 40.13,23 40.35,22.78 | v41.57,24 40.35,22.78 | C16.2 39.97,20.8 40.64,21.47 40.64,22.49 40.35,22.78
  Bottom 0.178: IC1.7 18.54,20.96 20.93,23.35 31.39,23.35 32.06,22.68 36.99,22.68 v37.03,22.72 | D3.3 41.57,23 v41.57,24
LINE1LP2  (via drill 0.38)
  Top 0.178: v47.11,26.55 47.61,27.06 50.97,27.06 C20.2
  Bottom 0.178: IC2.7 30.82,20.26 30.82,20.8 31.98,21.97 35.69,21.97 36.56,21.1 37.97,21.1 | 37.97,21.1 38.1,20.97 38.1,19.19 38.36,18.93 41.4,18.93 D2.3 | 37.97,21.1 38.74,21.1 38.99,21.35 38.99,23.38 38.16,24.21 38.16,26.43 38.32,26.59 38.9,26.59 39.23,26.91 40.04,26.91 40.07,26.94 41.77,26.94 42.01,26.71 46.95,26.71 v47.11,26.55
LINE1LP3  (via drill 0.38)
  Top 0.178: v39.68,21.93 37.94,21.93 37.11,21.1 36.56,21.1 36.17,21.48 36.17,21.91 35.97,22.12 35.97,22.59 v34.55,24.01
  Bottom 0.178: IC3.7 6.35,22.74 6.99,23.38 7.45,23.38 7.82,23.75 13.96,23.75 14.61,24.39 19.18,24.39 19.56,24.01 20.59,24.01 20.64,24.06 31.69,24.06 32.36,23.39 34.55,23.39 | 34.55,23.39 36.21,23.39 36.83,24.01 36.83,24.74 36.6,24.97 36.6,26.11 37.41,26.91 37.64,26.91 38.09,27.37 38.68,27.37 38.97,27.66 42.07,27.66 42.3,27.42 46.53,27.42 46.72,27.61 50,27.61 50.25,27.87 50.25,32.44 C24.2 | D6.3 39.68,23.22 v39.68,21.93 | v34.55,24.01 34.55,23.39
LINE1RP1  (via drill 0.38)
  Top 0.178: v36.83,21.76 36.32,22.26 36.32,23.51 37.94,25.12 C17.1
  Bottom 0.178: IC1.9 19.54,21.45 21.08,23 31.24,23 31.92,22.32 36.26,22.32 v36.83,21.76 37.54,21.76 D4.3
LINE1RP2  (via drill 0.38)
  Top 0.178: C21.1 50.55,28.42 50.55,28.08 50.04,27.57 47.19,27.57 46.45,26.83 46.45,25.83 47.5,24.78 47.5,18.93 46.48,17.92 41.91,17.92 41.66,17.66 41.66,17.41 41.15,16.9 39.63,16.9 v38.86,17.66
  Bottom 0.178: 35.31,21.6 36.32,20.58 36.32,19.19 36.43,19.09 36.43,18.66 36.81,18.27 37.24,18.27 37.76,17.75 D5.3 38.19,17.66 v38.86,17.66
  Bottom 0.203: 35.31,21.6 32.13,21.6 31.73,21.2 IC2.9
LINE1RP3
  Bottom 0.178: IC3.9 7.35,20.73 6.86,21.22 6.86,22.74 7.11,23 7.57,23 7.97,23.39 12.05,23.39 12.94,22.5 19.58,22.5 20.78,23.71 31.54,23.71 32.21,23.04 36.41,23.04 37.19,23.81 37.19,24.89 36.96,25.12 36.96,25.96 37.55,26.55 37.78,26.55 38.24,27.01 38.82,27.01 39.08,27.26 39.89,27.26 39.93,27.3 41.92,27.3 42.16,27.06 46.68,27.06 46.87,27.25 50.14,27.25 50.61,27.72 50.61,28.55 50.68,28.62 50.68,29.09 51.52,29.94 D7.3 52.33,31.04 C25.1
MICBIAS  (via drill 0.38)
  Bottom 0.178: IC2.13 34.76,19.65 v35.05,19.95
N$1
  Top 0.178: R20.P$1 43.63,21.73 J1.2
N$2  (via drill 0.38)
  Top 0.406: v52.75,7.58 52.39,7.58 52.17,7.81 48.21,7.81 47.5,8.52 41.91,8.52 40.52,9.91 C6.C
  Bottom 0.406: R12.P$2 52.75,7.51 v52.75,7.58
N$3  (via drill 0.38)
  Top 0.406: C7.C 34.88,7.94 39.47,7.94 39.81,8.28 40.55,8.28 40.89,7.94 47.26,7.94 47.97,7.22 51.92,7.22 52.83,6.31 v52.83,5.22
  Bottom 0.406: R13.P$2 52.83,5.29 v52.83,5.22
N$4
  Top 0.178: R21.P$1 41.05,26.14 42.93,24.27 J1.3
N$5
  Top 0.178: R16.P$1 55.63,31.13 56.9,29.86 J3.2
N$6  (via drill 0.38)
  Top 0.254: v1.53,7.76 2.29,7.8 D1.P$2
  Bottom 0.254: R14.P$2 3.41,10.37 1.53,8.18 v1.53,7.76
N$7
  Top 0.178: R17.P$1 58.42,32.65 J3.3
N$8  (via drill 0.38)
  Top 0.406: C12.C 15.71,8.27 v18.29,8.27
  Bottom 0.406: v18.29,8.27 18.62,8.6 39.3,8.6 39.57,8.86 41.32,8.86 41.66,8.52 47.25,8.52 47.96,7.81 49.81,7.81 49.86,7.76 50.55,7.76 51.04,7.26 51.04,5.23 52.07,4.2 53.07,4.2 R1.P$2
N$9
  Bottom 0.178: R18.P$1 55.55,32.57 56.64,33.67 60.71,33.67 61.47,32.9 61.47,22.49 60.71,21.73 J4.2
N$10  (via drill 0.38)
  Top 0.406: v19.81,7.5 19.7,7.5 19.62,7.41 12.82,7.41 12.52,7.11 11.87,7.11 11.57,7.41 10.68,7.41 C13.C
  Bottom 0.406: v19.81,7.5 20.32,8.01 39.55,8.01 39.81,8.28 40.88,8.28 41.4,7.76 46.99,7.76 47.53,7.22 49.57,7.22 49.62,7.17 50.31,7.17 50.46,7.02 50.46,4.8 52.71,2.55 R2.P$2
N$11
  Bottom 0.178: J4.3 57.41,24.27 56.24,25.44 56.24,26.9 R19.P$1
N$13  (via drill 0.38)
  Top 0.254: v4.07,7.76 3.3,7.8 D1.P$1
  Bottom 0.254: R15.P$2 4.45,8.95 4.09,8.6 4.07,7.94 v4.07,7.76
N$15
  Bottom 0.254: R14.P$1 7.55,10.37 8.13,9.79 8.13,7.42 8.45,7.1 P1.4
N$16
  Bottom 0.254: R15.P$1 5.53,8.93 5.92,8.54 5.96,6.12 P1.2
N$22
  Top 0.203: P1.29 41.47,3.37 43.18,1.66 51.31,1.66 51.82,2.17 51.82,4.71 R23.P$2
N$23
  Top 0.203: R22.P$1 50.58,4.71 49.79,4.71 49.09,5.4 P1.36
N$54  (via drill 0.38)
  Top 0.406: C8.C 26.8,12.18 28.31,13.69 33.29,13.69 33.72,14.12 34.49,14.12 34.77,13.84 35.55,13.84 36.2,14.49 37.21,14.49 v37.59,14.11
  Bottom 0.406: R10.P$2 38.36,14.11 v37.59,14.11
N$58  (via drill 0.38)
  Top 0.203: SW1.1 3.87,27.51 v3.69,27.06
  Bottom 0.254: R3.P$1 3.88,27 v3.69,27.06
N$59  (via drill 0.38)
  Top 0.406: C9.C 22.56,8.06 27.49,8.06 28.45,9.03 28.45,10.81 27.94,11.31 27.94,12.33 28.72,13.1 32.58,13.1 33.36,12.33 35.48,12.33 35.75,12.6 36.82,12.6 v36.83,12.58
  Bottom 0.406: R11.P$2 38.51,12.18 38.04,12.65 37.27,12.65 37.21,12.58 v36.83,12.58
RESETN  (via drill 0.38)
  Top 0.178: v34.75,16.35 32.77,14.36 27.94,14.36 26.82,13.24 26.82,13.07 26.44,12.69 25.89,12.69 v25.02,11.82
  Route2 0.178: v4.83,12.33 14.44,12.33 15.1,11.67 17.27,11.67 | 23.88,11.82 22.4,11.82 22.12,11.54 20.56,11.54 20.43,11.67 17.27,11.67 | 27.94,17.66 27.94,17.9 33.89,23.84 33.89,24.38 36.06,26.55 36.83,26.55 | v17.27,12.33 17.27,11.67
  Route2 0.203: 23.88,11.82 v25.02,11.82 28.7,11.82 v28.96,12.08 | P2.26 36.43,31.48 38.1,33.16 44.2,33.16 45.21,32.14 45.21,28.33 44.45,27.57 41.4,27.57 40.39,26.55 36.83,26.55 | 27.94,17.66 27.94,16.65 28.45,16.14 34.55,16.14 v34.75,16.35
  Bottom 0.178: IC3.33 4.85,12.35 v4.83,12.33 | IC1.33 17.04,12.56 v17.27,12.33
  Bottom 0.203: IC2.33 29.23,12.35 v28.96,12.08
SCL  (via drill 0.38)
  Top 0.178: v37.59,11.87 37.82,11.87 38.38,12.44 38.38,14.46 37.11,15.73 36.56,15.73 36.02,16.27 v36.02,17.97
  Top 0.203: v33.78,26.55 33.78,25.41 32.39,24.01 29.49,24.01 v27.2,21.73
  Route2 0.178: v3.05,21.22 3.56,20.71 4.07,20.71 5.11,21.75 9.06,21.75 10,22.69 10.8,22.69 11.05,22.13 11.6,21.58 12.47,21.58 12.87,21.98 14.48,21.98 v14.7,21.75 | 35.98,18.77 35.98,18.01 v36.02,17.97 | P1.28 37.59,7.42 v37.59,11.87
  Route2 0.203: v14.7,21.75 15.05,21.46 15.64,20.97 17.45,20.97 17.84,21.35 20.83,21.35 21.47,20.97 25.91,20.97 26.67,21.73 v27.2,21.73 | 35.98,18.77 35.98,19.97 35.45,20.51 35.45,23.76 35.56,23.87 v35.56,24.27
  Bottom 0.178: IC1.1 15.56,21.01 v14.7,21.75 | IC3.1 3.35,20.92 v3.05,21.22 | R24.P$1 33.33,25.66 34.17,25.66
  Bottom 0.203: IC2.1 27.73,21.2 v27.2,21.73 | v35.56,24.27 34.17,25.66 34.17,26.17 v33.78,26.55
SDA  (via drill 0.38)
  Top 0.178: v36.58,11.57 36.97,11.57 37.32,11.21 37.87,11.21 38.25,11.6 38.25,11.72 38.74,12.2 38.74,14.74 37.49,15.99 37.49,16.92 36.92,17.49 v36.92,17.61
  Route2 0.178: v4.02,21.59 4.45,21.59 4.96,22.11 8.79,22.11 9.91,23.23 12.22,23.23 13.02,22.43 15.48,22.43 16.07,21.83 v17.23,21.83 | v35.82,25.28 35.82,24.95 36.22,24.54 36.22,23.99 35.82,23.59 35.82,20.71 36.43,20.1 36.43,18.66 36.92,18.16 v36.92,17.61 | P1.26 36.39,11.38 v36.58,11.57
  Route2 0.203: v17.23,21.83 20.91,21.83 21.72,21.35 24.64,21.35 | 24.64,21.35 25.66,21.35 26.8,22.49 28.2,22.49 28.79,21.9 v28.79,21.76 | v34.55,27.32 33.53,27.32 32.77,26.55 32.77,25.03 31.24,23.51 25.4,23.51 24.51,22.62 24.51,21.47 24.64,21.35
  Bottom 0.178: IC1.2 16.04,20.64 v17.23,21.83 | IC3.2 3.85,21.43 v4.02,21.59 | 35.31,25.79 v35.82,25.28 | R25.P$1 32.01,26.43 32.9,27.32 v34.55,27.32
  Bottom 0.203: IC2.2 28.23,21.21 v28.79,21.76 | 35.31,25.79 35.31,26.55 v34.55,27.32
SHUTDOWN_REQ/
  Bottom 0.203: R3.P$2 2.29,26.3 2.29,26.81 4.32,28.84 4.32,31.63 5.59,32.9 45.13,32.9 P2.34

### Text on the board
tPlace: D1 | D2 | D3 | D4 | D5 | D6 | D7 | D8 | D9 | D0 | IN2-3 | GND | 3.3V | D10 | D11 | D12 | IN0-1 | IN4-5 | OUT0-1 | OUT2-3 | Mini Multichannel Expander | 3.3V | D15 | D14 | GND | 5V | OUT4-5 | Augmented Instruments Ltd 07/21 | bela.io | rev. A2 | D13
bPlace: P2 | P1
tNames: SW1 | D1